# EAGLE design Adafruit Prop Maker FeatherWing (EAGLE 9.2.0)
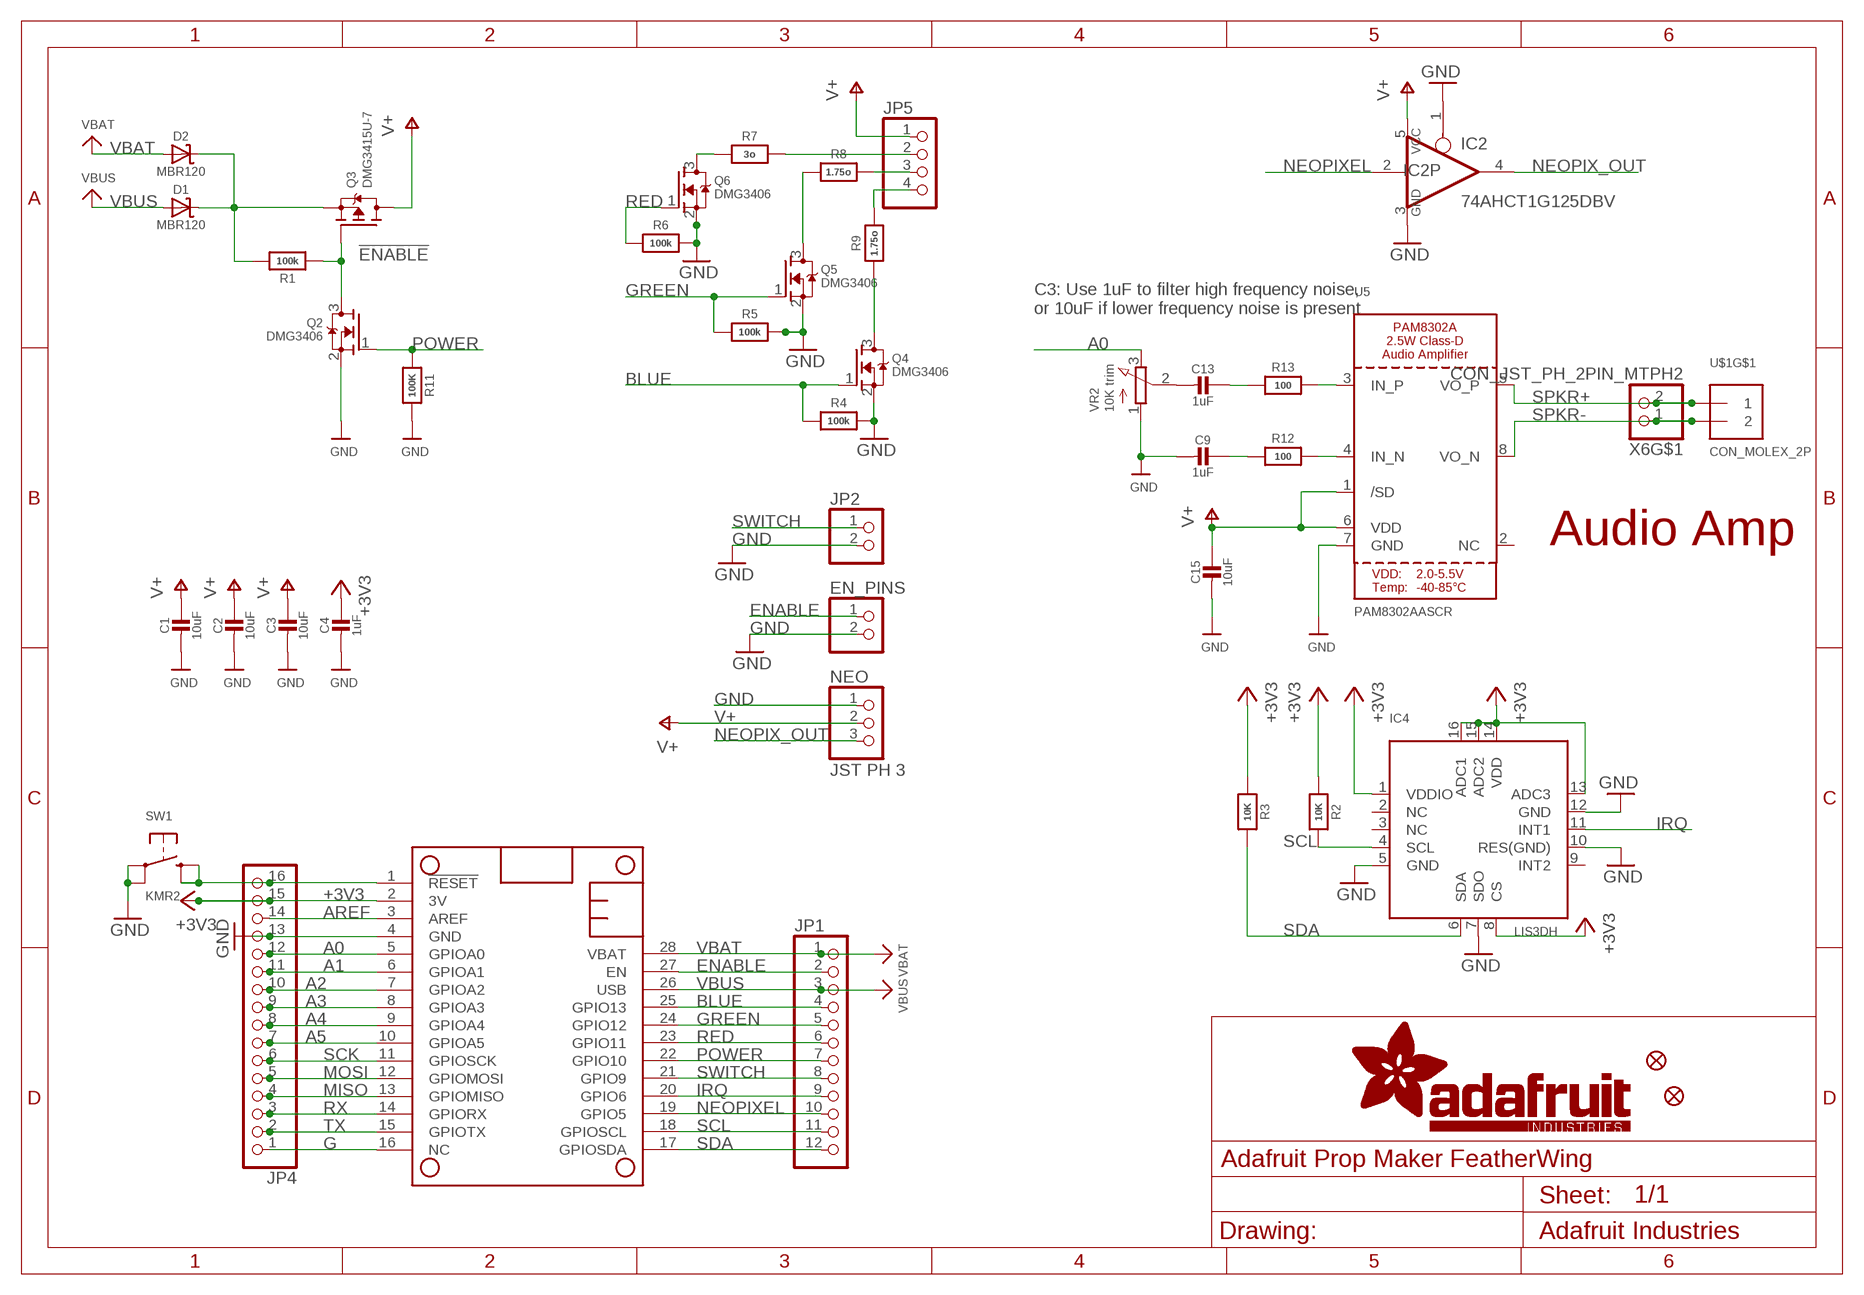
[diagram p0: schematic, sheet 1]

## Parts
C1  10uF  CAP_CERAMIC0805-NOOUTLINE  [0805-NO]
C2  10uF  CAP_CERAMIC0805-NOOUTLINE  [0805-NO]
C3  10uF  CAP_CERAMIC0805-NOOUTLINE  [0805-NO]
C4  1uF  CAP_CERAMIC0603_NO  [0603-NO]
C9  1uF  CAP_CERAMIC0603_NO  [0603-NO]
C13  1uF  CAP_CERAMIC0603_NO  [0603-NO]
C15  10uF  CAP_CERAMIC0805-NOOUTLINE  [0805-NO]
D1  MBR120  DIODE-SCHOTTKYSOD-123  [SOD-123]
D2  MBR120  DIODE-SCHOTTKYSOD-123  [SOD-123]
EN_PINS  HEADER-1X2ROUND  [1X02_ROUND]
FID1  FIDUCIAL_1MM  [FIDUCIAL_1MM]
FID3  FIDUCIAL_1MM  [FIDUCIAL_1MM]
IC2  74AHCT1G125DBV  [SOT23-5]
IC4  LIS3DH  ACCEL_LIS3DHTR  [LGA16_3X3MM]
JP1  HEADER-1X12  [1X12_ROUND]
JP2  HEADER-1X2ROUND  [1X02_ROUND]
JP4  HEADER-1X16ROUND  [1X16_ROUND]
JP5  HEADER-1X4ROUND  [1X04_ROUND]
MS1  FEATHERWING  [FEATHERWING]
NEO  JST PH 3  CON_JST_PH_3PIN  [JSTPH3]
Q2  DMG3406  MOSFET-NWIDE  [SOT23-WIDE]
Q3  DMG3415U-7  MOSFET-PWIDE  [SOT23-WIDE]
Q4  DMG3406  MOSFET-NWIDE  [SOT23-WIDE]
Q5  DMG3406  MOSFET-NWIDE  [SOT23-WIDE]
Q6  DMG3406  MOSFET-NWIDE  [SOT23-WIDE]
R1  100k  RESISTOR_0603_NOOUT  [0603-NO]
R2  10K  RESISTOR_0603_NOOUT  [0603-NO]
R3  10K  RESISTOR_0603_NOOUT  [0603-NO]
R4  100k  RESISTOR_0603_NOOUT  [0603-NO]
R5  100k  RESISTOR_0603_NOOUT  [0603-NO]
R6  100k  RESISTOR_0603_NOOUT  [0603-NO]
R7  3o  RESISTOR_1206  [_1206]
R8  1.75o  RESISTOR_1206  [_1206]
R9  1.75o  RESISTOR_1206  [_1206]
R11  100K  RESISTOR_0603_NOOUT  [0603-NO]
R12  100  RESISTOR_0603_NOOUT  [0603-NO]
R13  100  RESISTOR_0603_NOOUT  [0603-NO]
SW1  KMR2  SWITCH_TACT_SMT4.6X2.8  [BTN_KMR2_4.6X2.8]
U5  PAM8302AASCR  AUDIOAMP_PAM8302A  [MSOP8_0.65MM]
U$1  CON_MOLEX_2P  [53398-0271]
VR2  10K trim  TRIMPOT3303W/X  [TRIMPOT_BOURNS_3303W]
X6  CON_JST_PH_2PIN_MTPH2  [JSTPH2]

## Nets
!ENABLE: Q2.3(D) Q3.1(G) R1.1
+3V3 [power]: C4.1 IC4.1(VDDIO) IC4.8(CS) IC4.13(ADC3) IC4.14(VDD) IC4.15(ADC2) IC4.16(ADC1) JP4.15 MS1.2(3V) R2.1 R3.1
A0: JP4.12 MS1.5(GPIOA0) VR2.3(E)
A1: JP4.11 MS1.6(GPIOA1)
A2: JP4.10 MS1.7(GPIOA2)
A3: JP4.9 MS1.8(GPIOA3)
A4: JP4.8 MS1.9(GPIOA4)
A5: JP4.7 MS1.10(GPIOA5)
AREF: JP4.14 MS1.3(AREF)
BLUE: JP1.4 MS1.25(GPIO13) Q4.1(G) R4.1
ENABLE: EN_PINS.1 JP1.2 MS1.27(EN)
G: JP4.1 MS1.16(NC)
GND: C1.2 C2.2 C3.2 C4.2 C9.2 C15.2 EN_PINS.2 IC2.1(OE) IC2.3(GND) IC4.5(GND) IC4.7(SDO) IC4.10(RES(GND)) IC4.12(GND) JP2.2 JP4.13 MS1.4(GND) NEO.1 Q2.2(S) Q4.2(S) Q5.2(S) Q6.2(S) R4.2 R5.2 R6.2 R11.2 SW1.A'(P1) SW1.A(P) U5.7(GND) VR2.1(A)
GREEN: JP1.5 MS1.24(GPIO12) Q5.1(G) R5.1
IRQ: IC4.11(INT1) JP1.9 MS1.20(GPIO6)
MISO: JP4.4 MS1.13(GPIOMISO)
MOSI: JP4.5 MS1.12(GPIOMOSI)
N$1: Q6.3(D) R7.1
N$2: JP5.3 R8.2
N$3: JP5.4 R9.2
N$4: Q4.3(D) R9.1
N$6: Q5.3(D) R8.1
N$7: JP5.2 R7.2
N$19: R12.2 U5.4(IN_N)
N$20: R13.2 U5.3(IN_P)
N$21: C9.1 R12.1
N$22: C13.1 R13.1
N$23: C13.2 VR2.2(S)
N$139: D1.C D2.C Q3.2(S) R1.2
NEOPIX_OUT: IC2.4(O) NEO.3
NEOPIXEL: IC2.2(I) JP1.10 MS1.19(GPIO5)
POWER: JP1.7 MS1.22(GPIO10) Q2.1(G) R11.1
RED: JP1.6 MS1.23(GPIO11) Q6.1(G) R6.1
RESET: JP4.16 MS1.1(!RESET) SW1.B'(S1) SW1.B(S)
RX: JP4.3 MS1.14(GPIORX)
SCK: JP4.6 MS1.11(GPIOSCK)
SCL: IC4.4(SCL) JP1.11 MS1.18(GPIOSCL) R2.2
SDA: IC4.6(SDA) JP1.12 MS1.17(GPIOSDA) R3.2
SPKR+: U5.5(VO_P) U$1.1 X6.2
SPKR-: U5.8(VO_N) U$1.2 X6.1
SWITCH: JP1.8 JP2.1 MS1.21(GPIO9)
TX: JP4.2 MS1.15(GPIOTX)
V+ [thickpower]: C1.1 C2.1 C3.1 C15.1 IC2.5(VCC) JP5.1 NEO.2 Q3.3(D) U5.1(/SD) U5.6(VDD)
VBAT: D2.A JP1.1 MS1.28(VBAT)
VBUS: D1.A JP1.3 MS1.26(USB)
Unconnected: IC4.2(NC) IC4.3(NC) IC4.9(INT2) U5.2(NC) U$1.M1(MT) U$1.M2(MT) X6.NC1 X6.NC2

## Notes on the sheet
- C3: Use 1uF to filter high frequency noise,
  or 10uF if lower frequency noise is present
- Audio Amp

## Library data of the parts
C1-C4 C9 C13 C15 = microbuilder:CAP_CERAMIC: Ceramic Capacitors For new designs, use the packages preceded by an '_' character since they are more reliable: The following footprints should be used on most boards: _0402 - Standard footprint for regular board layouts _0603 - Standard footprint for regular board layouts _0805 - Standard footprint for regular board layouts _1206 - Standard footprint for regular board layouts For extremely tight-pitch boards where space is at a premium, the following 'micro-pitch' footprints can be used (smaller pads, no silkscreen outline, etc.): _0402MP - Micro-pitch footprint for very dense/compact boards _0603MP - Micro-pitch footprint for very dense/compact boards _0805MP - Micro-pitch footprint for very dense/compact boards _1206MP - Micro-pitch footprint for very dense/compact boards
D1 D2 = microbuilder:DIODE-SCHOTTKY
EN_PINS JP2 = microbuilder:HEADER-1X2: PIN HEADER
FID1 FID3 = microbuilder:FIDUCIAL: Fiducial Alignment Points Various fiducial points for machine vision alignment.; BOM: EXCLUDE
IC2 = 74xx-little-us:74*1G125: Single Bus Buffer Gate with 3-State Output
IC4 = microbuilder:ACCEL_LIS3DHTR: LIS3DHTR 3-Axis Accelerometer with I2C/SPI Interface VDD: 1.71-3.6V VDDIO: 1.71-VDD+0.1V Scale: +/-2g, 4g, 8g, 16g with 16--bit data output Temp:: -40°C - 85°C Mouser: 511-LIS3DHTR Digikey: 497-10613-1-ND
JP1 = microbuilder:HEADER-1X12
JP4 = microbuilder:HEADER-1X16: PIN HEADER
JP5 = microbuilder:HEADER-1X4: PIN HEADER
MS1 = microbuilder:FEATHERWING
NEO = microbuilder:CON_JST_PH_3PIN
Q2 Q4-Q6 = microbuilder:MOSFET-N: N-Channel Mosfet LEGEND VDS: Voltage Drain-Source ID: Drain Current RDS(ON): Drain-Source On-State Resistance VGS(TH): Gate-Source Threshold Voltage CISS: Drain-Source Input Capacitance SOT-23 Name VDS ID RDS(ON) VGS(TH) CISS Order Number 2N7002E 60V 260mA 2.5 Ohm 2.5V @ 250uA 26.7pF @ 25V 2N7002ET1GOSTR-ND BSH103 30V 850mA 400 mOhm 400mV @ 1mA 83pF @ 24V BSH103,235-ND BSS138 60V 320mA 1.6 Ohm 1.5V @ 250uA 50pF @ 10V Mouser: 771-BSS138PW115 DMN2075U-7 20V 4.2A 38 mOhm 1V @ 250 uA 594.3pF @ 10V DMN2075U-7DICT-ND * BSS138 good choice for I2C level-shifting POWERPAK 1212-8 Name VDS ID RDS(ON) VGS(TH) CISS Order Number Si7308DN 60V 6A 58 mOhm 3V @ 250uA 665pF @ 15V SI7308DN-T1-E3CT-ND
Q3 = microbuilder:MOSFET-P: P-Channel Mosfet LEGEND VDS: Voltage Drain-Source ID: Drain Current RDS(ON): Drain-Source On-State Resistance VGS(TH): Gate-Source Threshold Voltage CISS: Drain-Source Input Capacitance SOT-23 Name VDS ID RDS(ON) VGS(TH) CISS Order Number IRLML5103 30V 760mA 600 mOhm -- 75pF @ 25V Digikey: IRLML5103PBFCT-ND IRLML6401 12V 4.3A 50 mOhm 950mV @ 250µA 830pF @ 10V Digikey: IRLML6401PBFTR-ND NTR0202PL 20V 400mA 800 mOhm 2.3V @ 250uA 70pF @ 5V Digikey: NTR0202PLT1GOSTR-ND NTR4101PT1G 20V 1.8A 85 mOhm 1.2V @ 250uA 675pF @ 10V Digikey: NTR4101PT1GOSCT-ND DMP2004K 20V 600mA 900 mOhm 1V @ 250uA 175pF @ 16V Digikey: DMP2004KDICT-ND PMV65XP 20V 3.9A 76 mOhm 950mV @ 1mA 725pF @ 20V Digikey: 568-2358-2-ND TO-252 Name VDS ID RDS(ON) VGS(TH) CISS Order Number AOD417 30V 25A 34 mOhm 3V @ 250µA 920pF @ 15V Digikey: 785-1106-2-ND PowerPak Name VDS ID RDS(ON) VGS(TH) CISS Order Number AON7401 30V 12A 14 mOhm 3V @ 250µA 2600pF @ 15V Digikey: 785-1302-1-ND
R1-R9 R11-R13 = microbuilder:RESISTOR: Resistors For new designs, use the packages preceded by an '_' character since they are more reliable: The following footprints should be used on most boards: _0402 - Standard footprint for regular board layouts _0603 - Standard footprint for regular board layouts _0805 - Standard footprint for regular board layouts _1206 - Standard footprint for regular board layouts For extremely tight-pitch boards where space is at a premium, the following 'micro-pitch' footprints can be used (smaller pads, no silkscreen outline, etc.): _0402MP - Micro-pitch footprint for very dense/compact boards _0603MP - Micro-pitch footprint for very dense/compact boards _0805MP - Micro-pitch footprint for very dense/compact boards _1206MP - Micro-pitch footprint for very dense/compact boards
SW1 = microbuilder:SWITCH_TACT_SMT: SMT Tact Switches 6x6mm - Digikey: P12940SCT-ND KMR2 (4.6x2.8mm) - Digikey: 401-1426-1-ND EVQ-PQHB55 - Light Touch, 160GF (4.5x4.5mm) - Digikey: P8090SCT-ND KMT0 - KMT021 NGJ LHS (etc.) IP68/Waterproof - Digikey: CKN10289CT-ND
U5 = microbuilder:AUDIOAMP_PAM8302A: PAM8302A - 2.5W Class-D Mono Audio Amplifier MSOP8 = PAM8302AASCR
U$1 = microbuilder:CON_MOLEX_2P
VR2 = microbuilder:TRIMPOT: 3-Pin SMT Trimpots Bourns TC33 (X-2) Series 1K - Digikey: TC33X-102ECT-ND 10K - Digikey: TC33X-2-103E 100K - Digikey: TC33X-104ECT-ND Bourns 3303 (W) Series 3mm 10K Single Turn - Digikey: 3303W-103ETR-ND 3mm 100K Single Turn - Digikey: 3303X-104ETR-ND
X6 = microbuilder:CON_JST_PH_2PIN_MT

## Net classes
1 power: width 0.305 mm
2 thickpower: width 0.406 mm

## Board
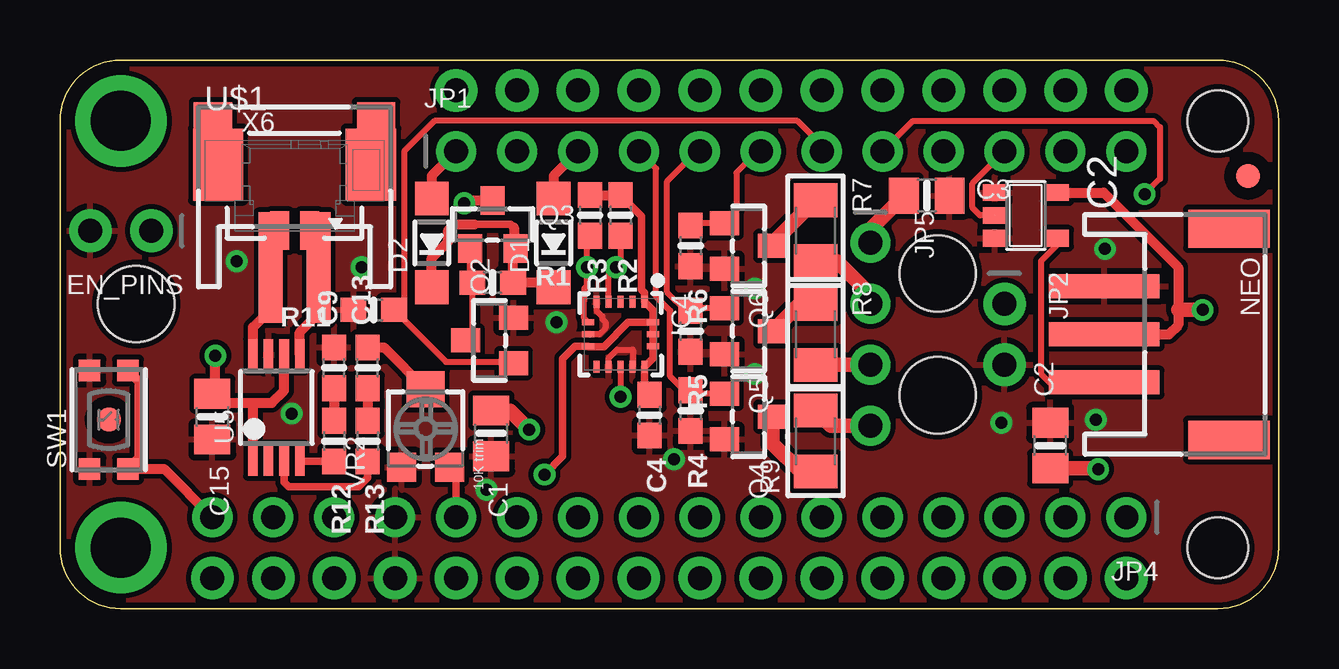
[diagram p1: board, top side]
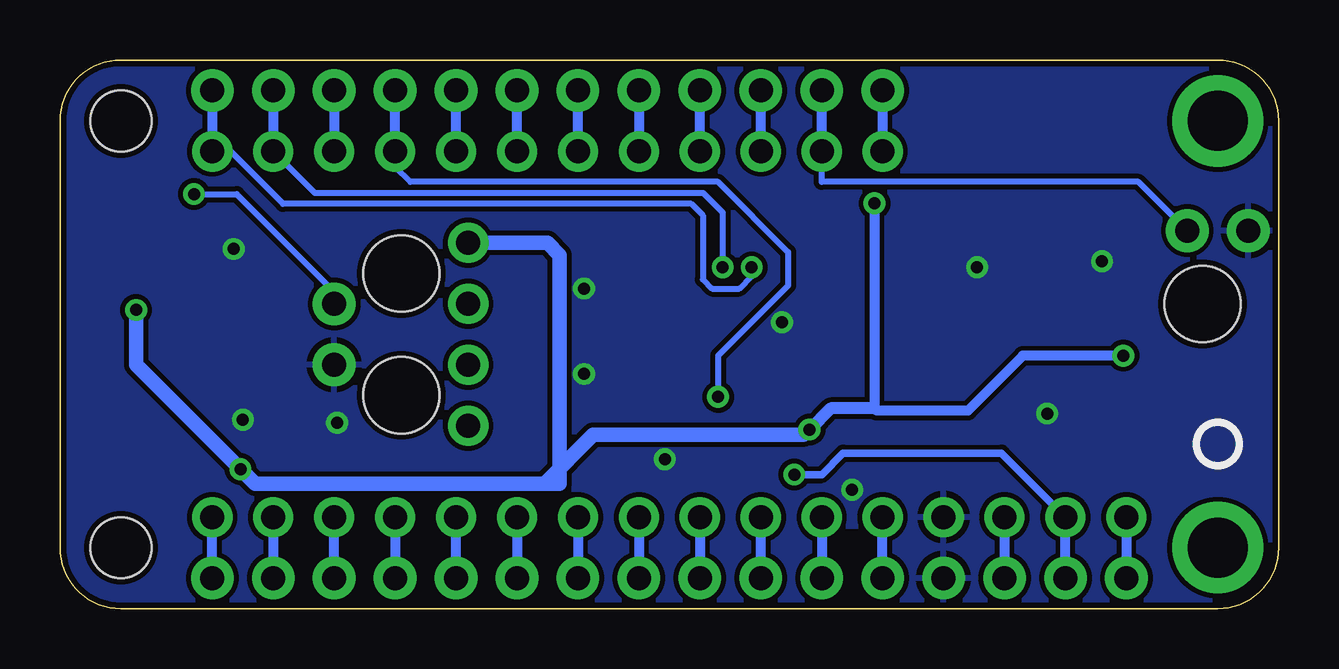
[diagram p2: board, bottom side, seen from below]

Size 50.8 x 22.86 mm. Coordinates in mm from the lower left corner, seen from the top.
Outline: 2.54,22.86 48.26,22.86 arc-90 50.8,20.32 50.8,2.54 arc-90 48.26,0 2.54,0 arc-90 0,2.54 0,20.32 arc-90 2.54,22.86
Copper layers (1*16): Top 0.035mm / dielectric 1.5mm / Bottom 0.035mm
Design rules "adafruit *": minimum track width 8mil, minimum drill 15.5mil, track to track 8mil, track to pad 8mil, pad to pad 8mil, via to via 8mil, smd to smd 8mil, copper to edge 10mil, drill to drill 8mil, minimum pad ring 10mil, minimum via ring 8mil, stop-mask expansion 2mil, vias tented up to drill 20mil, thermal gap 10mil
Holes 3.17 mm at 3.17,12.7 36.58,13.97 36.58,8.89
bRestrict: area 17.5,3.2 to 18,3.3

### Footprints (pad centres in the part's own frame; a part is rotated, then mirrored left to right if it is on the bottom)
0805-NO = smd 1.24 x 1.5: 1 -0.95,0; 2 0.95,0
0603-NO = smd 1.075 x 1: 1 -0.85,0; 2 0.85,0
SOD-123 = smd 1.4 x 1.4: A 1.85,0; C -1.85,0
1X02_ROUND = drill 1 pad 1.778: 1 -1.27,0; 2 1.27,0
FIDUCIAL_1MM = smd 1 x 1: 1 0,0
SOT23-5 = smd 0.69 x 0.99: 1 -0.95,-1.29; 2 0,-1.29; 3 0.95,-1.29; 4 0.95,1.3; 5 -0.95,1.3
LGA16_3X3MM = smd 0.5 x 0.25: 1 -1.35,1; 2 -1.35,0.5; 3 -1.35,0; 4 -1.35,-0.5; 5 -1.35,-1; 9 1.35,-1; 10 1.35,-0.5; 11 1.35,0; 12 1.35,0.5; 13 1.35,1 | smd 0.25 x 0.5: 6 -0.5,-1.35; 7 0,-1.35; 8 0.5,-1.35; 14 0.5,1.35; 15 0,1.35; 16 -0.5,1.35
1X12_ROUND = drill 1 pad 1.676: 1 -13.97,0; 2 -11.43,0; 3 -8.89,0; 4 -6.35,0; 5 -3.81,0; 6 -1.27,0; 7 1.27,0; 8 3.81,0; 9 6.35,0; 10 8.89,0; 11 11.43,0; 12 13.97,0
1X16_ROUND = drill 1 pad 1.676: 1 -19.05,0; 2 -16.51,0; 3 -13.97,0; 4 -11.43,0; 5 -8.89,0; 6 -6.35,0; 7 -3.81,0; 8 -1.27,0; 9 1.27,0; 10 3.81,0; 11 6.35,0; 12 8.89,0; 13 11.43,0; 14 13.97,0; 15 16.51,0; 16 19.05,0
1X04_ROUND = drill 1 pad 1.676: 1 -3.81,0; 2 -1.27,0; 3 1.27,0; 4 3.81,0
FEATHERWING = drill 1 pad 1.778: 1 6.35,1.27; 2 8.89,1.27; 3 11.43,1.27; 4 13.97,1.27; 5 16.51,1.27; 6 19.05,1.27; 7 21.59,1.27; 8 24.13,1.27; 9 26.67,1.27; 10 29.21,1.27; 11 31.75,1.27; 12 34.29,1.27; 13 36.83,1.27; 14 39.37,1.27; 15 41.91,1.27; 16 44.45,1.27; 17 44.45,21.59; 18 41.91,21.59; 19 39.37,21.59; 20 36.83,21.59; 21 34.29,21.59; 22 31.75,21.59; 23 29.21,21.59; 24 26.67,21.59; 25 24.13,21.59; 26 21.59,21.59; 27 19.05,21.59; 28 16.51,21.59 | drill 2.5 pad 3.81: P$1 2.54,20.32; P$2 2.54,2.54 | hole 2.54: 48.26,20.32; 48.26,2.54
JSTPH3 = smd 1 x 4.6: 1 -2,-2.7; 2 0,-2.7; 3 2,-2.7 | smd 1.6 x 3.4: NC1 -4.4,2.5; NC2 4.4,2.5
SOT23-WIDE = smd 1 x 1.2: 1 -0.95,-1; 2 0.95,-1; 3 0,1
_1206 = smd 1.4 x 1.8: 1 -1.27,0; 2 1.27,0
BTN_KMR2_4.6X2.8 = smd 0.9 x 0.9: A 2.05,0.8; A' -2.05,0.8; B 2.05,-0.8; B' -2.05,-0.8
MSOP8_0.65MM = smd 0.4 x 1.3: 1 -0.975,-2.2; 2 -0.325,-2.2; 3 0.325,-2.2; 4 0.975,-2.2; 5 0.975,2.2; 6 0.325,2.2; 7 -0.325,2.2; 8 -0.975,2.2
53398-0271 = smd 0.8 x 1.6: 1 0.625,-1.27; 2 -0.625,-1.27 | smd 2.1 x 3: M1 3.185,1.48; M2 -3.185,1.48
TRIMPOT_BOURNS_3303W = smd 1.2 x 1.2: 1 -1,-1.6; 3 1,-1.6 | smd 1.6 x 1.5: 2 0,1.65
JSTPH2 = smd 1 x 4.6: 1 -1,-3.7; 2 1,-3.7 | smd 1.6 x 3.4: NC1 -3.4,1.5; NC2 3.4,1.5

### Placement (x,y rotation side)
C1  17.97,7.3 270 top
C2  41.27,6.79 90 top
C3  36.13,17.21 0 top
C4  24.57,8.06 270 top
C9  11.43,10.03 90 top
C13  12.83,10.03 90 top
C15  6.35,8 270 top
D1  20.57,15.24 90 top
D2  15.49,15.24 90 top
EN_PINS  2.54,15.75 180 top
FID1  49.53,18.03 0 top
FID3  2.03,7.87 0 top
IC2  40.26,16.38 270 top
IC4  23.37,11.43 270 top
JP1  30.48,19.05 0 top
JP2  39.37,11.43 270 top
JP4  25.4,3.81 180 top
JP5  33.78,11.43 270 top
MS1  0,0 0 top
NEO  46.23,11.43 270 top
Q2  17.91,11.18 90 top
Q3  18.03,16 0 top
Q4  28.7,8 270 top
Q5  28.7,11.56 270 top
Q6  28.7,15.11 270 top
R1  18.03,13.59 0 top
R2  23.37,16.38 270 top
R3  22.1,16.38 270 top
R4  26.29,8.26 270 top
R5  26.29,11.56 270 top
R6  26.29,15.11 270 top
R7  31.5,15.75 270 top
R8  31.5,11.43 270 top
R9  31.5,6.99 90 top
R11  13.08,12.45 180 top
R12  11.43,6.99 270 top
R13  12.83,6.99 270 top
SW1  2.03,7.87 90 top
U5  9.02,8.38 0 top
U$1  9.78,17.02 0 top
U$6  [PROPMAKER_BOT]  50.8,0 0 bottom
U$14  [PROPMAKER_TOP]  0,0 0 top
U$15  [PCBFEAT-REV-040]  2.54,6.86 0 bottom
VR2  15.24,7.49 0 top
X6  9.78,17.91 0 top

### Tracks (layer width: path | path; a pad name or v marks a point on that pad's centre or on a via)
!ENABLE
  Top 0.254: Q3.1 17.08,13.69 R1.1 17.18,11.45 Q2.3
+3V3  (via drill 0.5)
  Top 0.305: IC4.16 23.68,11.93 22.67,10.92 IC4.8 21.47,10.93 20.95,10.41 20.95,6.35 v20.19,5.59 | IC4.16 IC4.15 IC4.14 24.72,10.43 IC4.13 24.37,9.12 C4.1 | IC4.16 24.72,12.43 IC4.1 24.37,13.16 24.24,13.29 24.24,16.34 24.24,16.36 R2.1
  Top 0.406: R3.1 R2.1
  Bottom 0.305: JP4.15 10.67,5.59 11.56,6.48 18.16,6.48 19.05,5.59 v20.19,5.59
  Bottom 0.406: MS1.2 JP4.15
A0
  Top 0.305: VR2.3 16.51,5.62 JP4.12
  Bottom 0.406: MS1.5 JP4.12
A1
  Bottom 0.406: JP4.11 MS1.6
A2
  Bottom 0.406: MS1.7 JP4.10
A3
  Bottom 0.406: JP4.9 MS1.8
A4
  Bottom 0.406: JP4.8 MS1.9
A5
  Bottom 0.406: JP4.7 MS1.10
AREF
  Bottom 0.406: JP4.14 MS1.3
BLUE
  Top 0.254: Q4.1 26.44,8.95 R4.1 26.01,9.11 25.43,9.68 25.43,12.42 24.85,12.99 24.85,18.33 JP1.4
  Bottom 0.406: JP1.4 MS1.25
ENABLE
  Bottom 0.254: EN_PINS.1 5.84,17.78 19.05,17.78 JP1.2
  Bottom 0.406: JP1.2 MS1.27
G
  Bottom 0.406: MS1.16 JP4.1
GND  (via drill 0.5)
  Top 0.254: IC4.5 22.37,12.42 22.6,12.19 22.6,12.07 22.73,11.94 22.73,11.68 22.48,11.43 IC4.7 | IC4.10 22.87,10.44 23.04,10.61 23.23,10.79 23.88,10.79 IC4.12
  other vias: 7.37,14.48 12.57,14.22 9.65,8.13 20.7,11.94 17.78,4.95 25.59,6.22 28.96,13.34 28.96,9.78 43.56,14.99 43.18,7.87 39.24,7.75
  pour Top: 0,22.86 0,0 50.8,0 50.8,22.86
  pour Bottom: 0,22.86 0,0 50.8,0 50.8,22.86
GREEN
  Top 0.254: Q5.1 26.39,12.51 R5.1 26.09,12.41 25.31,13.19 25.31,17.82 26.54,19.05 JP1.5
  Bottom 0.406: MS1.24 JP1.5
IRQ  (via drill 0.5)
  Top 0.254: IC4.11 v23.37,8.83
  Bottom 0.254: v23.37,8.83 23.37,10.54 23.18,10.73 20.45,13.46 20.45,14.86 23.37,17.78 36.2,17.78 36.83,18.41 JP1.9
  Bottom 0.406: JP1.9 MS1.20
MISO
  Bottom 0.406: JP4.4 MS1.13
MOSI
  Bottom 0.406: MS1.12 JP4.5
N$1
  Top 0.61: Q6.3 29.7,15.22 R7.1
N$2
  Top 0.61: JP5.3 R8.2
N$3
  Top 0.61: JP5.4 32.13,7.62 R9.2
N$4
  Top 0.61: Q4.3 29.7,6.87 30.86,5.71 R9.1
N$6
  Top 0.61: R8.1 30.84,12.7 Q5.3
N$7
  Top 0.61: R7.2 32.38,14.48 33.78,13.08 JP5.2
N$19
  Top 0.305: U5.4 10.04,6.13 R12.2
N$20
  Top 0.305: R13.2 12.83,5.46 12.45,5.08 9.53,5.08 9.34,5.26 U5.3
N$21
  Top 0.406: C9.1 R12.1
N$22
  Top 0.406: C13.1 R13.1
N$23
  Top 0.406: C13.2 13.5,10.88 VR2.2
N$139
  Top 0.305: 17.27,16.01 18.79,16.01 18.92,15.88
  Top 0.406: D2.C 15.49,14.61 16.18,15.29 16.18,15.77 16.42,16.01 17.27,16.01 | D1.C 20.38,13.59 R1.2 18.88,14.9 | 18.88,14.9 Q3.2 | 18.92,15.88 18.92,14.94 18.88,14.9
NEOPIX_OUT
  Top 0.254: IC2.4 41.56,15.14 40.89,14.48 40.89,9.78 41.27,9.4 43.94,9.4 44.07,9.27 43.91,9.43 NEO.3
NEOPIXEL
  Top 0.254: IC2.2 38.35,16.38 38.04,16.7 38.04,17.72 JP1.10
  Bottom 0.406: MS1.19 JP1.10
POWER
  Top 0.254: JP1.7 31.75,19.3 30.73,20.32 15.62,20.32 14.35,19.05 14.35,12.54 14.02,12.54 R11.1 16.09,10.29 18.85,10.29 Q2.1
  Bottom 0.406: JP1.7 MS1.22
RED
  Top 0.254: R6.1 26.39,16.06 Q6.1 28.19,16.55 28.19,18.16 29.08,19.05 JP1.6
  Bottom 0.406: JP1.6 MS1.23
RESET
  Top 0.406: SW1.B 3.3,9.45 3.3,6.29 SW1.B' 4.34,5.82 JP4.16
  Bottom 0.406: JP4.16 MS1.1
RX
  Bottom 0.406: MS1.14 JP4.3
SCK
  Bottom 0.406: JP4.6 MS1.11
SCL  (via drill 0.5)
  Top 0.254: R2.2 23.37,14.41 v23.18,14.22 22.87,13.91 IC4.4
  Bottom 0.254: JP1.11 40.18,17.32 23.99,17.32 23.18,16.51 v23.18,14.22
  Bottom 0.406: MS1.18 JP1.11
SDA  (via drill 0.5)
  Top 0.254: IC4.6 21.84,12.1 21.84,12.83 21.84,13.34 21.97,13.46 | 21.97,13.46 21.97,15.03 22.1,15.15 R3.2 | v21.97,14.22 21.97,13.46
  Bottom 0.254: v21.97,14.22 21.97,13.97 21.97,13.84 22.48,13.34 23.62,13.34 24,13.72 24,16.38 24.49,16.87 41.5,16.87 43.69,19.05 JP1.12
  Bottom 0.406: MS1.17 JP1.12
SPKR+
  Top 0.406: U5.5 9.99,11.52 10.79,12.32 10.79,14.19 X6.2 10.78,15.37 U$1.1
SPKR-
  Top 0.406: U5.8 8.04,11.72 8.78,12.46 X6.1 8.78,15.37 U$1.2
SWITCH  (via drill 0.5)
  Top 0.254: JP1.8 35.56,20.32 45.59,20.32 45.85,20.07 45.85,17.91 v45.21,17.27
  Bottom 0.254: v45.21,17.27 43.43,17.27 39.37,13.21 JP2.1
  Bottom 0.406: JP1.8 MS1.21
TX
  Bottom 0.406: JP4.2 MS1.15
V+  (via drill 0.5)
  Top 0.406: 8,8.57 6.73,8.57 C15.1 6.48,9.08 v6.48,10.54 | 8,8.57 8.82,8.57 9.34,9.09 U5.6 | U5.1 8.04,8.53 8,8.57 | IC2.5 43.5,17.33 46.61,14.22 46.61,12.45 46.61,11.81 46.23,11.43 | NEO.2 46.23,11.43 | 46.23,11.43 | Q3.3 16.96,17 v16.85,16.89
  Top 0.61: 46.61,12.45 v47.62,12.45 | C2.1 43.24,5.84 v43.27,5.81 | C3.1 33.78,15.81 JP5.1 | C1.1 18.77,8.25 v19.56,7.46
  Bottom 0.406: v6.48,10.54 10.67,10.54 12.95,8.26 16.76,8.26 16.85,8.34 v16.85,16.89
  Bottom 0.508: 16.85,8.34 18.68,8.34 v19.56,7.46 19.59,7.46 19.81,7.24
  Bottom 0.61: 19.81,7.24 28.57,7.24 30.61,5.21 31.62,5.21 | JP5.1 30.48,15.24 29.97,14.73 29.97,5.21 31.62,5.21 | v47.62,12.45 47.62,10.16 v43.27,5.81 42.67,5.21 31.62,5.21
VBAT
  Top 0.406: JP1.1 15.49,18.03 D2.A
  Bottom 0.406: MS1.28 JP1.1
VBUS
  Top 0.406: JP1.3 20.57,18.03 D1.A
  Bottom 0.406: JP1.3 MS1.26